# Altium schematic sheet LINEARDriver_DC.SchDoc
size 594 x 420 mm; DocumentNumber: BSV.23-KUBODRIVER Э3; SheetNumber: 3; Format: A2
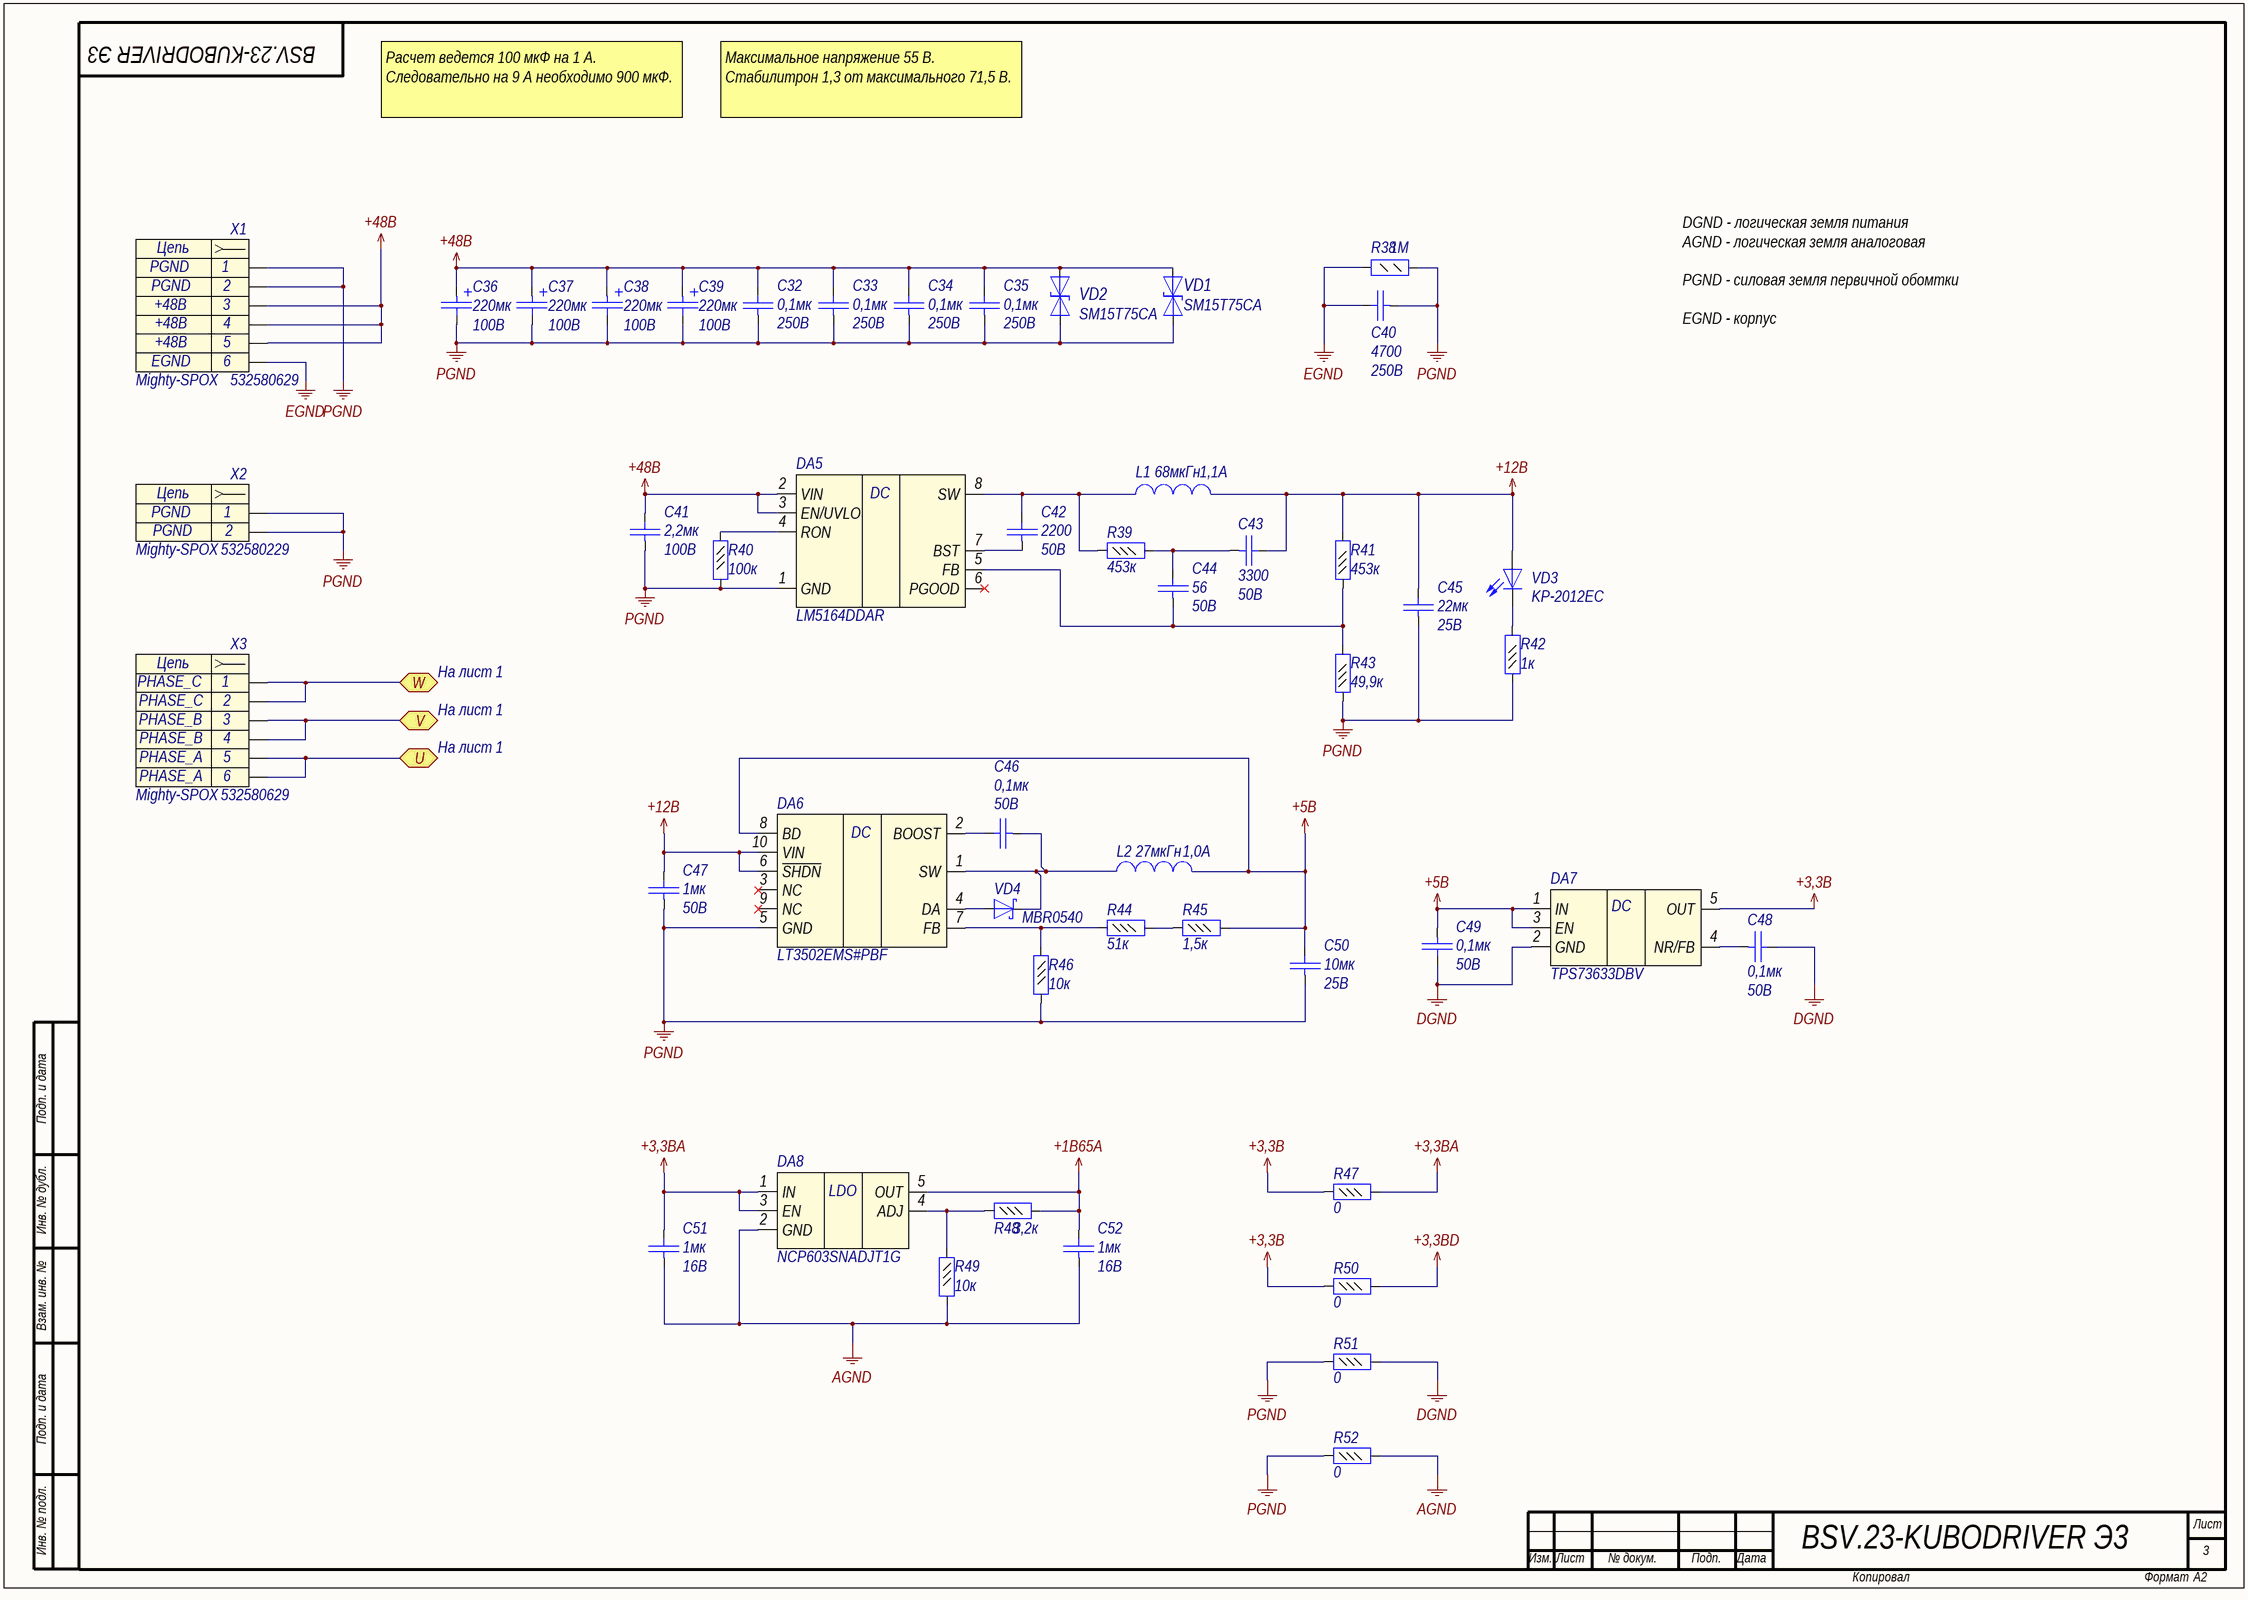
[diagram p0: LINEARDriver_DC.SchDoc]

## Parts
C32  value 0,1мк  Voltage: 250В  [C1206]  (hidden comment: Capacitor)
C33  value 0,1мк  Voltage: 250В  [C1206]  (hidden comment: Capacitor)
C34  value 0,1мк  Voltage: 250В  [C1206]  (hidden comment: Capacitor)
C35  value 0,1мк  Voltage: 250В  [C1206]  (hidden comment: Capacitor)
C36  value 220мк  Voltage: 100B  [K50-35(12.5X25)_V]  (hidden comment: Capacitor_pol)
C37  value 220мк  Voltage: 100B  [K50-35(12.5X25)_V]  (hidden comment: Capacitor_pol)
C38  value 220мк  Voltage: 100B  [K50-35(12.5X25)_V]  (hidden comment: Capacitor_pol)
C39  value 220мк  Voltage: 100B  [K50-35(12.5X25)_V]  (hidden comment: Capacitor_pol)
C40  value 4700  Voltage: 250В  [C0805]  (hidden comment: Capacitor)
C41  Voltage: 100В  [C1210]  (hidden comment: 2,2мк)
C42  value 2200  Voltage: 50B  [C0402]  (hidden comment: Capacitor)
C43  value 3300  Voltage: 50В  [C0402]  (hidden comment: Capacitor)
C44  value 56  Voltage: 50B  [C0402]  (hidden comment: Capacitor)
C45  value 22мк  Voltage: 25B  [C1210]  (hidden comment: Capacitor)
C46  value 0,1мк  Voltage: 50В  [C0402]  (hidden comment: Capacitor)
C47  value 1мк  Voltage: 50B  [C0805]  (hidden comment: Capacitor)
C48  value 0,1мк  Voltage: 50В  [C0402]  (hidden comment: Capacitor)
C49  value 0,1мк  Voltage: 50В  [C0402]  (hidden comment: Capacitor)
C50  value 10мк  Voltage: 25В  [C1206]  (hidden comment: Capacitor)
C51  value 1мк  Voltage: 16B  [C0603]  (hidden comment: Capacitor)
C52  value 1мк  Voltage: 16B  [C0603]  (hidden comment: Capacitor)
DA5  Part Number: LM5164DDAR  [SO Powerpad8]  (hidden comment: LM5164)
DA6  Part Number: LT3502EMS#PBF  [MSOP10]  (hidden comment: LT3502_MS)
DA7  Part Number: TPS73633DBV  [SOT23-5]  (hidden comment: TPS736DBV)
DA8  Part Number: NCP603SNADJT1G  [TSOP5]  (hidden comment: NCP603)
L1  value 68мкГн  Rated Current: 1,1A  [SDR1006]  (hidden comment: Inductor)
L2  value 27мкГн  Rated Current: 1,0A  [SDR0604]  (hidden comment: Inductor)
R38  value 1М  [R0805]  (hidden comment: Resistor_0,125Вт)
R39  value 453к  [R0402]  (hidden comment: Resistor_0,062Вт)
R40  value 100к  [R0402]  (hidden comment: Resistor_0,062Вт)
R41  value 453к  [R0402]  (hidden comment: Resistor_0,062Вт)
R42  value 1к  [R0402]  (hidden comment: Resistor_0,062Вт)
R43  value 49,9к  [R0402]  (hidden comment: Resistor_0,062Вт)
R44  value 51к  [R0402]  (hidden comment: Resistor_0,062Вт)
R45  value 1,5к  [R0402]  (hidden comment: Resistor_0,062Вт)
R46  value 10к  [R0402]  (hidden comment: Resistor_0,062Вт)
R47  value 0  [R0603]  (hidden comment: Resistor_0,062Вт)
R48  value 3,2к  [R0402]  (hidden comment: Resistor_0,062Вт)
R49  value 10к  [R0402]  (hidden comment: Resistor_0,062Вт)
R50  value 0  [R0603]  (hidden comment: Resistor_0,062Вт)
R51  value 0  [R0603]  (hidden comment: Resistor_0,062Вт)
R52  value 0  [R0603]  (hidden comment: Resistor_0,062Вт)
VD1  Part Number: SM15T75CA  [SMC]  (hidden comment: DiodeZenerDual)
VD2  Part Number: SM15T75CA  [SMC]  (hidden comment: DiodeZenerDual)
VD3  Part Number: KP-2012EC  [L_0805]  (hidden comment: LED)
VD4  Part Number: MBR0540  [SOD-123]  (hidden comment: DiodeSchottky)
X1  Part Name: Mighty-SPOX  Part Number: 532580629  [MOLEX_532580629]  (hidden comment: Header_6_sct)
X2  Part Name: Mighty-SPOX  Part Number: 532580229  [MOLEX_532580229]  (hidden comment: Header_2_sct)
X3  Part Name: Mighty-SPOX  Part Number: 532580629  [MOLEX_532580629]  (hidden comment: Header_6_sct)

## Ports
U, V, W

## Nets
+1B65A: C52.2 DA8.5(OUT) R48.2
+3,3B: DA7.5(OUT) R47.1 R50.1
+3,3BA: C51.2 DA8.1(IN) DA8.3(EN) R47.2
+3,3BD: R50.2
+5B: C49.1 C50.2 DA6.8(BD) DA7.1(IN) DA7.3(EN) L2.2 R45.2
+12B: C43.2 C45.2 C47.2 DA6.6(~{SHDN}) DA6.10(VIN) L1.2 R41.2 VD3.2(A)
+48B: C32.2 C33.2 C34.2 C35.2 C36.1 C37.1 C38.1 C39.1 C41.2 DA5.2(VIN) DA5.3(EN/UVLO) VD1.1(K) VD2.2(A) X1.3 X1.4 X1.5
AGND: C51.1 C52.1 DA8.2(GND) R49.2 R52.2
DGND: C48.2 C49.2 DA7.2(GND) R51.2
EGND: C40.2 R38.2 X1.6
PGND: C32.1 C33.1 C34.1 C35.1 C36.2 C37.2 C38.2 C39.2 C40.1 C41.1 C45.1 C47.1 C50.1 DA5.1(GND) DA6.5(GND) R38.1 R40.2 R42.1 R43.1 R46.2 R51.1 R52.1 VD1.2(A) VD2.1(K) X1.1 X1.2 X2.1 X2.2
U: X3.5 X3.6 ; port U
V: X3.3 X3.4 ; port V
W: X3.1 X3.2 ; port W
NetC42_1: C42.1 DA5.7(BST)
NetC42_2: C42.2 DA5.8(SW) L1.1 R39.1
NetC43_1: C43.1 C44.2 R39.2
NetC44_1: C44.1 DA5.5(FB) R41.1 R43.2
NetC46_1: C46.1 DA6.1(SW) L2.1 VD4.1(K)
NetC46_2: C46.2 DA6.2(BOOST)
NetC48_1: C48.1 DA7.4(NR/FB)
NetDA5_4: DA5.4(RON) R40.1
NetDA6_4: DA6.4(DA) VD4.2(A)
NetDA6_7: DA6.7(FB) R44.1 R46.1
NetDA8_4: DA8.4(ADJ) R48.1 R49.1
NetR42_2: R42.2 VD3.1(K)
NetR44_2: R44.2 R45.1

Not connected (* = marked no-connect by the designer): DA5 6(PGOOD)*; DA6 3(NC)* 9(NC)*

## Notes on the sheet
- Расчет ведется 100 мкФ на 1 А.
  Следовательно на 9 А необходимо 900 мкФ.
- Максимальное напряжение 55 В.
  Стабилитрон 1,3 от максимального 71,5 В.
- DGND - логическая земля питания
  AGND - логическая земля аналоговая
  PGND - силовая земля первичной обомтки
  EGND - корпус
- На лист 1
- Подп. и дата
- Инв. № дубл.
- Взам. инв. №
- Инв. № подл.
- Лист
- Изм.
- № докум.
- Подп.
- Дата
- Копировал
- Формат
- (in symbol connect103) Цепь
- (in symbol connect105) Цепь
- (in symbol pwr102) DC
- (in symbol pwr112) DC
- (in symbol pwr113) DC
- (in symbol pwr124) LDO

## Library data of the parts
C32-C35 = cap179: Конденсатор; Part Name: Ceramic; Manufacture: Murata; Part Number: GRM31CR72E104K; id: cap179; TKE: X7R
C36-C39 = cap279: Конденсатор полярный; Part Name: Electrolit; Manufacture: Epcos; Part Number: B41851A9227M000; id: cap279; tga: 0,10%; ESR: 75мОм; Iac max: 0,4А; Iac rated: 0,6А
C40 = cap211: Конденсатор; Part Name: Ceramic; Manufacture: Murata; Part Number: GRM21AR72E472KW; id: cap211; TKE: X7R
C41 = cap288: Конденсатор; Part Name: Ceramic; Manufacture: Murata; Part Number: GCJ32DR72A225KA01L; id: cap288; TKE: X7R; tga: 0,10%; Value: 2,2мк
C42 = cap34: Конденсатор; Part Name: Ceramic; Manufacture: Murata; Part Number: GRM155R71H222K; id: cap34; TKE: X7R
C43 = cap283: Конденсатор; Part Name: Ceramic; Manufacture: Murata; Part Number: GRM155R71H332KA01D; id: cap283; TKE: NP0; tga: 0,10%
C44 = cap16: Конденсатор; Part Name: Ceramic; Manufacture: Murata; Part Number: GRM1555C1H560J*; id: cap16; TKE: NP0
C45 = cap280: Конденсатор; Part Name: MLCC; Manufacture: Taiyo Yuden; Part Number: TMK325B7226KMHT; id: cap280; TKE: X7R; tga: 0,10%
C46 C48 C49 = cap277: Конденсатор; Part Name: Ceramic; Manufacture: Murata; Part Number: GRM155R71H104KE14D; id: cap277; TKE: X7R; tga: 0,10%
C47 = cap151: Конденсатор; Part Name: Ceramic; Manufacture: Murata; Part Number: GRM21BR71H105K; id: cap151; TKE: X7R
C50 = cap186: Конденсатор; Part Name: Ceramic; Manufacture: Murata; Part Number: GRM31CR71E106KA12L*; id: cap186; TKE: X7R
C51 C52 = cap133: Конденсатор; Part Name: Ceramic; Manufacture: Murata; Part Number: GRM188R71C105KA12D**; id: cap133; TKE: X7R
DA5 = pwr102: 1-A synchronous buck DC/DC converter with ultra-low IQ; Manufacturer: Texas Instruments; id: pwr102; Input Voltage: 6B-100B; Output Voltage: 1,2B-90B; Current: 1A; Frequency: 1MHz; Part Name: 1-A synchronous buck DC/DC converter with ultra-low IQ; Type: Impulse
DA6 = pwr112: 1.1MHz/2.2MHz, 500mA  Step-Down Regulators; Part Name: 1-A synchronous buck DC/DC converter with ultra-low IQ; Manufacturer: Linear Technology; id: pwr112; Input Voltage: 40B; Output Voltage: Adj; Current: 0,5А; Frequency: 2,2MHz; Type: Impulse
DA7 = pwr113: 400-mA Low-Dropout Regulator with Reverse Current  Protection; Manufacturer: Texas Instruments; id: pwr113; Input Voltage: 1,7-5,5В; Output Voltage: 3,3B; Dropout Voltage: 75mB; Current: 400mA; Part Name: Low-Dropout Regulator with Reverse Current Protection; Type: Linear
DA8 = pwr124: High Performance  CMOS LDO Regulator with  Enable and Enhanced ESD  Protection; Part Name: High Performance LDO Regulator with ESD Protection; Manufacturer: ON Semiconductor; id: pwr124; Input Voltage: 1,7-6В; Output Voltage: Adj; Dropout Voltage: 175mB; Current: 300mA; Type: Linear
L1 = ind109: EMI Suppression Filter; Part Name: SMD Power Inductors; Part Number: SDR1006- 680KL; Manufacture: Bourns; id: ind109; Saturation Current: 2,0A; Resistance: 0,22Ohm
L2 = ind47: EMI Suppression Filter; Part Name: SMD Power Inductors; Part Number: SDR0604- 270YL; Manufacture: Bourns; id: ind47; Saturation Current: 1,3A; Resistance: 0,22Ohm
R38 = res149: Резистор; Manufacture: Yageo; Part Number: RC0805FR-071ML; id: res149; Accuracy: 0,01; Part Name: Resistor; Power: 0,125Вт
R39 R41 = res1155: Резистор; Manufacture: Yageo; Part Number: RC0402FR-07453KL; Accuracy: 0,01; id: res1155; Part Name: Resistor; Power: 0,062Вт
R40 = res318: Резистор; Manufacture: Yageo; Part Number: RC0402FR-07100KL; id: res318; Accuracy: 0,01; Part Name: Resistor; Power: 0,062Вт
R42 = res270: Резистор; Manufacture: Yageo; Part Number: RC0402FR-071KL; id: res270; Accuracy: 0,01; Part Name: Resistor; Power: 0,062Вт
R43 = res1159: Резистор; Manufacture: Yageo; Part Number: RC0402FR-0749K9L; Accuracy: 0,01; id: res1159; Part Name: Resistor; Power: 0,062Вт
R44 = res311: Резистор; Manufacture: Yageo; Part Number: RC0402FR-0751KL; id: res311; Accuracy: 0,01; Part Name: Resistor; Power: 0,062Вт
R45 = res274: Резистор; Manufacture: Yageo; Part Number: RC0402FR-071K5; id: res274; Accuracy: 0,01; Part Name: Resistor; Power: 0,062Вт
R46 R49 = res294: Резистор; Manufacture: Yageo; Part Number: RC0402FR-0710KL; id: res294; Accuracy: 0,01; Part Name: Resistor; Power: 0,062Вт
R47 R50-R52 = res390: Резистор; Manufacture: Yageo; Part Number: RC0603FR-070RL; id: res390; Accuracy: 0,01; Part Name: Resistor; Power: 0,062Вт
R48 = res1170: Резистор; Manufacture: Yageo; Part Number: RT0402BRD073K2L; Accuracy: 0,01; id: res1170; Part Name: Resistor; Power: 0,062Вт
VD1 VD2 = SM15T75CA: Cтабилитрон (диод выпрямительный лавинный) двусторонний; Part Name: TVS diode Bidirectional; Manufacture: ST Microelectronics; id: tvs280; Leakage Current: 0.2uA; Stand-off Voltage: 71.3B; Breakdown Voltage: 75B; Clamping voltage: 78.8B; Peak Pulse Power: 1500W; Number of diodes: 1
VD3 = diode5: Светодиод; id: diode5; Part Name: LED
VD4 = diode15: Диод Шоттки; Manufacture: ON Semiconductor; Max Reverse Voltage: 40B; Forward Voltage: 0,62B; Forward Current: 0,5А; Capacitance: 30pF; Number of Channels: 1; id: diode15; Part Name: Diode Schottky
X1 = connect103: Разъем - 6 конт. розетка; Manufacture: Molex; Contact_1: PGND; Contact_3: +48B; Contact_6: EGND; Etch: 3.5mm; Contact_2: PGND; Contact_4: +48B; Contact_5: +48B; id: connect103
X2 = connect105: Разъем - 2 конт. розетка; Manufacture: Molex; Contact_1: PGND; Etch: 3.5mm; Contact_2: PGND; id: connect105
X3 = connect103: Разъем - 6 конт. розетка; Manufacture: Molex; Contact_1: PHASE_C; Contact_3: PHASE_B; Contact_5: PHASE_A; Etch: 3.5mm; Contact_2: PHASE_C; Contact_4: PHASE_B; Contact_6: PHASE_A; id: connect103